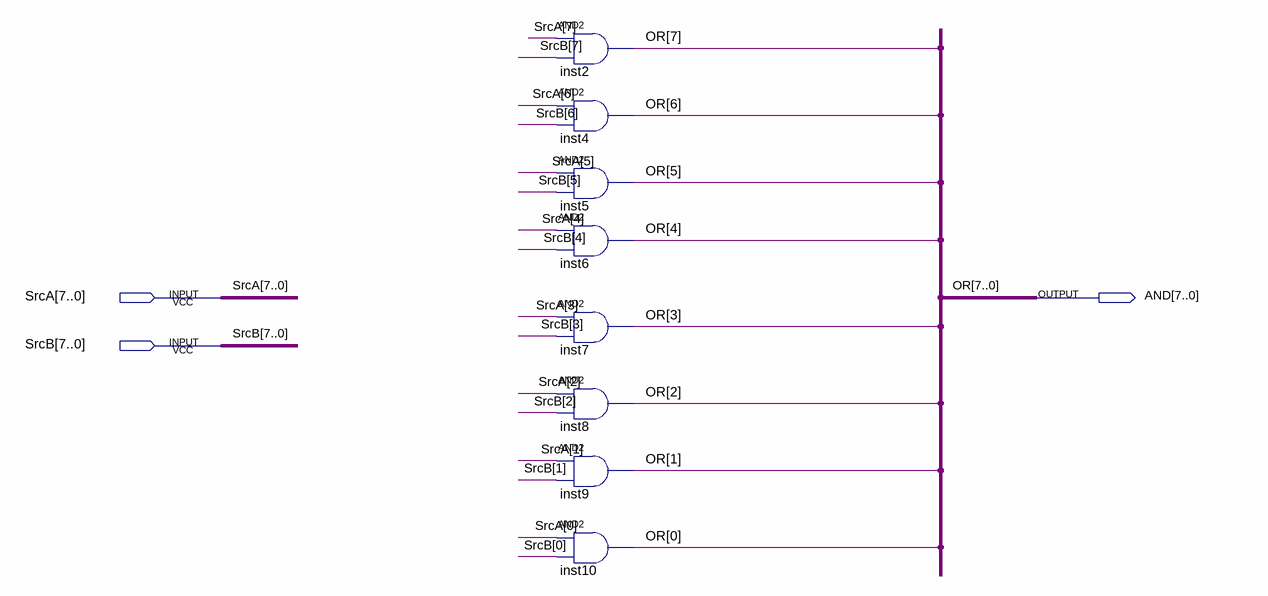
[diagram p0: schematic sheet]
// Quartus schematic ANDFODA.bdf as structural Verilog: 8 symbols, 3 pins
module ANDFODA (
  input  [7:0] SrcA,
  input  [7:0] SrcB,
  output [7:0] AND
);

  and inst2 (AND[7], SrcA[7], SrcB[7]);
  and inst4 (AND[6], SrcA[6], SrcB[6]);
  and inst5 (AND[5], SrcA[5], SrcB[5]);
  and inst6 (AND[4], SrcA[4], SrcB[4]);
  and inst7 (AND[3], SrcA[3], SrcB[3]);
  and inst8 (AND[2], SrcA[2], SrcB[2]);
  and inst9 (AND[1], SrcA[1], SrcB[1]);
  and inst10 (AND[0], SrcA[0], SrcB[0]);

  // Other names for the same wires on the sheet: OR[7:0] = AND
endmodule
